# EAGLE schematic motherboard (EAGLE 4.16)
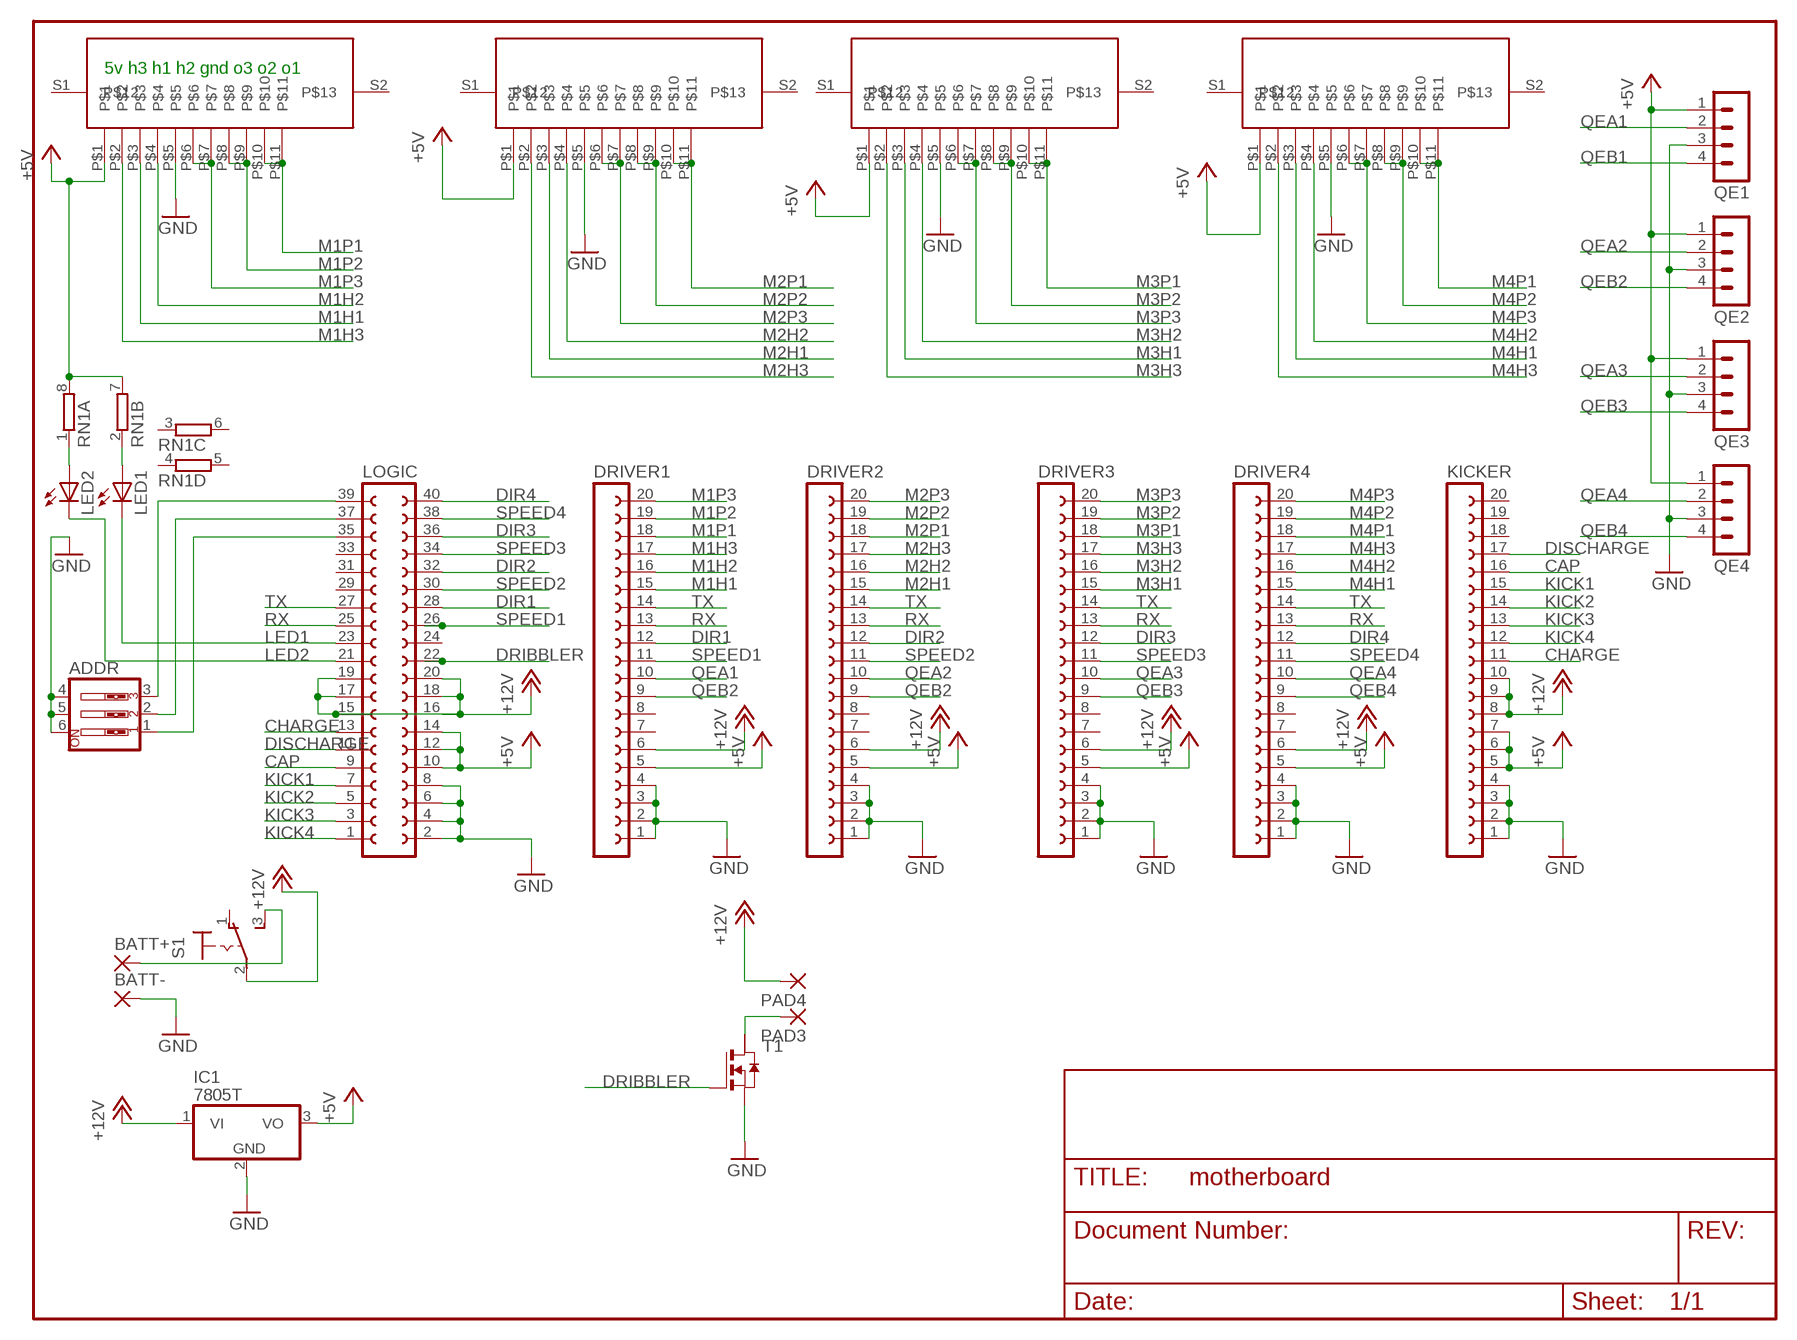
[diagram p0: schematic, sheet 1]

## Parts
ADDR  SW_DIP-3  [EDG-03]
BATT+  1,6/0,9  [1,6/0,9]
BATT-  1,6/0,9  [1,6/0,9]
DRIVER1  FE20-1  [FE20]
DRIVER2  FE20-1  [FE20]
DRIVER3  FE20-1  [FE20]
DRIVER4  FE20-1  [FE20]
IC1  7805T  [TO220H]
KICKER  FE20-1  [FE20]
LED1  LEDCHIPLED_0805  [CHIPLED_0805]
LED2  LEDCHIPLED_0805  [CHIPLED_0805]
LOGIC  FE20-2  [FE20-2]
MOTOR1  MOTORCONNECT  [53261-11]
MOTOR2  MOTORCONNECT  [53261-11]
MOTOR3  MOTORCONNECT  [53261-11]
MOTOR4  MOTORCONNECT  [53261-11]
PAD3  1,6/0,9  [1,6/0,9]
PAD4  1,6/0,9  [1,6/0,9]
QE1  MA04-1  [MA04-1]
QE2  MA04-1  [MA04-1]
QE3  MA04-1  [MA04-1]
QE4  MA04-1  [MA04-1]
RN1  4R-N0603-ARC  [0603-ARC]
S1  M9040P  [M9040P]
T1  NMOSSOT223  [SOT223]

## Nets
+5V: DRIVER1.5 DRIVER2.5 DRIVER3.5 DRIVER4.5 IC1.3(VO) KICKER.5 KICKER.6 KICKER.7 LOGIC.10 LOGIC.12 LOGIC.14 MOTOR1.P$1 MOTOR2.P$1 MOTOR3.P$1 MOTOR4.P$1 QE1.1 QE2.1 QE3.1 QE4.1 RN1.7 RN1.8
+12V: DRIVER1.6 DRIVER2.6 DRIVER3.6 DRIVER4.6 IC1.1(VI) KICKER.8 KICKER.9 KICKER.10 LOGIC.15 LOGIC.16 LOGIC.17 LOGIC.18 LOGIC.19 LOGIC.20 PAD4.1(P) S1.2(P)
ADDR1: ADDR.3 LOGIC.39
ADDR2: ADDR.2 LOGIC.37
ADDR3: ADDR.1 LOGIC.35
CAP: KICKER.16 LOGIC.9
CHARGE: KICKER.11 LOGIC.13
DIR1: DRIVER1.12 LOGIC.28
DIR2: DRIVER2.12 LOGIC.32
DIR3: DRIVER3.12 LOGIC.36
DIR4: DRIVER4.12 LOGIC.40
DISCHARGE: KICKER.17 LOGIC.11
DRIBBLER: LOGIC.22 T1.1(G)
GND: ADDR.4 ADDR.5 ADDR.6 BATT-.1(P) DRIVER1.1 DRIVER1.2 DRIVER1.3 DRIVER1.4 DRIVER2.1 DRIVER2.2 DRIVER2.3 DRIVER2.4 DRIVER3.1 DRIVER3.2 DRIVER3.3 DRIVER3.4 DRIVER4.1 DRIVER4.2 DRIVER4.3 DRIVER4.4 IC1.2(GND) KICKER.1 KICKER.2 KICKER.3 KICKER.4 LOGIC.2 LOGIC.4 LOGIC.6 LOGIC.8 MOTOR1.P$5 MOTOR2.P$5 MOTOR3.P$5 MOTOR4.P$5 QE1.3 QE2.3 QE3.3 QE4.3 T1.3(S)
KICK1: KICKER.15 LOGIC.7
KICK2: KICKER.14 LOGIC.5
KICK3: KICKER.13 LOGIC.3
KICK4: KICKER.12 LOGIC.1
LED1: LED1.C LOGIC.23
LED2: LED2.C LOGIC.21
M1H1: DRIVER1.15 MOTOR1.P$3
M1H2: DRIVER1.16 MOTOR1.P$4
M1H3: DRIVER1.17 MOTOR1.P$2
M1P1: DRIVER1.18 MOTOR1.P$10 MOTOR1.P$11
M1P2: DRIVER1.19 MOTOR1.P$8 MOTOR1.P$9
M1P3: DRIVER1.20 MOTOR1.P$6 MOTOR1.P$7
M2H1: DRIVER2.15 MOTOR2.P$3
M2H2: DRIVER2.16 MOTOR2.P$4
M2H3: DRIVER2.17 MOTOR2.P$2
M2P1: DRIVER2.18 MOTOR2.P$10 MOTOR2.P$11
M2P2: DRIVER2.19 MOTOR2.P$8 MOTOR2.P$9
M2P3: DRIVER2.20 MOTOR2.P$6 MOTOR2.P$7
M3H1: DRIVER3.15 MOTOR3.P$3
M3H2: DRIVER3.16 MOTOR3.P$4
M3H3: DRIVER3.17 MOTOR3.P$2
M3P1: DRIVER3.18 MOTOR3.P$10 MOTOR3.P$11
M3P2: DRIVER3.19 MOTOR3.P$8 MOTOR3.P$9
M3P3: DRIVER3.20 MOTOR3.P$6 MOTOR3.P$7
M4H1: DRIVER4.15 MOTOR4.P$3
M4H2: DRIVER4.16 MOTOR4.P$4
M4H3: DRIVER4.17 MOTOR4.P$2
M4P1: DRIVER4.18 MOTOR4.P$10 MOTOR4.P$11
M4P2: DRIVER4.19 MOTOR4.P$8 MOTOR4.P$9
M4P3: DRIVER4.20 MOTOR4.P$6 MOTOR4.P$7
N$1: LED2.A RN1.1
N$2: BATT+.1(P) S1.3(S)
N$3: LED1.A RN1.2
N$4: PAD3.1(P) T1.2(D)
QEA1: DRIVER1.10 QE1.2
QEA2: DRIVER2.10 QE2.2
QEA3: DRIVER3.10 QE3.2
QEA4: DRIVER4.10 QE4.2
QEB1: QE1.4
QEB2: DRIVER1.9 DRIVER2.9 QE2.4
QEB3: DRIVER3.9 QE3.4
QEB4: DRIVER4.9 QE4.4
RX: DRIVER1.13 DRIVER2.13 DRIVER3.13 DRIVER4.13 LOGIC.25
SPEED1: DRIVER1.11 LOGIC.26
SPEED2: DRIVER2.11 LOGIC.30
SPEED3: DRIVER3.11 LOGIC.34
SPEED4: DRIVER4.11 LOGIC.38
TX: DRIVER1.14 DRIVER2.14 DRIVER3.14 DRIVER4.14 LOGIC.27
Unconnected: DRIVER1.7 DRIVER1.8 DRIVER2.7 DRIVER2.8 DRIVER3.7 DRIVER3.8 DRIVER4.7 DRIVER4.8 KICKER.18 KICKER.19 KICKER.20 LOGIC.24 LOGIC.29 LOGIC.31 LOGIC.33 MOTOR1.S1 MOTOR1.S2 MOTOR2.S1 MOTOR2.S2 MOTOR3.S1 MOTOR3.S2 MOTOR4.S1 MOTOR4.S2 RN1.3 RN1.4 RN1.5 RN1.6 S1.1(O) T1.4(D2)

## Notes on the sheet
- 5v h3 h1 h2 gnd o3 o2 o1

## Library data of the parts
ADDR = special:SW_DIP-3: DIP SWITCH
BATT+ BATT- PAD3 PAD4 = wirepad:1,6/0,9: THROUGH-HOLE PAD
DRIVER1-DRIVER4 KICKER = con-lsta:FE20-1: FEMALE HEADER
IC1 = linear:78*: Positive VOLTAGE REGULATOR Source: http://cache.national.com/ds/LM/LM78L05.pdf http://www.fairchildsemi.com/ds/LM/LM7805.pdf
LED1 LED2 = led:LED: LED OSRAM: - CHIPLED LG R971, LG N971, LY N971, LG Q971, LY Q971, LO R971, LY R971 LH N974, LH R974 LS Q976, LO Q976, LY Q976 LO Q996 - Hyper CHIPLED LW Q18S LB Q993, LB Q99A, LB R99A - SideLED LS A670, LO A670, LY A670, LG A670, LP A670 LB A673, LV A673, LT A673, LW A673 LH A674 LY A675 LS A676, LA A676, LO A676, LY A676, LW A676 LS A679, LY A679, LG A679 - Hyper Micro SIDELED® LS Y876, LA Y876, LO Y876, LY Y876 LT Y87S - SmartLED LW L88C, LW L88S LB L89C, LB L89S, LG L890 LS L89K, LO L89K, LY L89K LS L896, LA L896, LO L896, LY L896 - TOPLED LS T670, LO T670, LY T670, LG T670, LP T670 LSG T670, LSP T670, LSY T670, LOP T670, LYG T670 LG T671, LOG T671, LSG T671 LB T673, LV T673, LT T673, LW T673 LH T674 LS T676, LA T676, LO T676, LY T676, LB T676, LH T676, LSB T676, LW T676 LB T67C, LV T67C, LT T67C, LS T67K, LO T67K, LY T67K, LW E67C LS E67B, LA E67B, LO E67B, LY E67B, LB E67C, LV E67C, LT E67C LW T67C LS T679, LY T679, LG T679 LS T770, LO T770, LY T770, LG T770, LP T770 LB T773, LV T773, LT T773, LW T773 LH T774 LS E675, LA E675, LY E675, LS T675 LS T776, LA T776, LO T776, LY T776, LB T776 LHGB T686 LT T68C, LB T68C - Hyper Mini TOPLED® LB M676 - Mini TOPLED Santana® LG M470 LS M47K, LO M47K, LY M47K Source: http://www.osram.convergy.de - LUMILED® LXK2-PW12-R00, LXK2-PW12-S00, LXK2-PW14-U00, LXK2-PW14-V00 LXK2-PM12-R00, LXK2-PM12-S00, LXK2-PM14-U00 LXK2-PE12-Q00, LXK2-PE12-R00, LXK2-PE12-S00, LXK2-PE14-T00, LXK2-PE14-U00 LXK2-PB12-K00, LXK2-PB12-L00, LXK2-PB12-M00, LXK2-PB14-N00, LXK2-PB14-P00, LXK2-PB14-Q00 LXK2-PR12-L00, LXK2-PR12-M00, LXK2-PR14-Q00, LXK2-PR14-R00 LXK2-PD12-Q00, LXK2-PD12-R00, LXK2-PD12-S00 LXK2-PH12-R00, LXK2-PH12-S00 LXK2-PL12-P00, LXK2-PL12-Q00, LXK2-PL12-R00 Source: www.luxeon.com
LOGIC = con-lsta:FE20-2: FEMALE HEADER
MOTOR1-MOTOR4 = brushless:MOTORCONNECT
QE1-QE4 = con-lstb:MA04-1: PIN HEADER
RN1 = resistor-dil:4R-N: Array Chip Resistor Source: RS Component / Phycomp
S1 = switch:M9040P: TOGGLE SWITCH Marquardt
T1 = zetex:NMOSSOT223: MOS FET

## Net classes
1 supply: width 0.508 mm
2 motor: width 0.508 mm